# Altium schematic sheet Driver Motor.SchDoc
size A
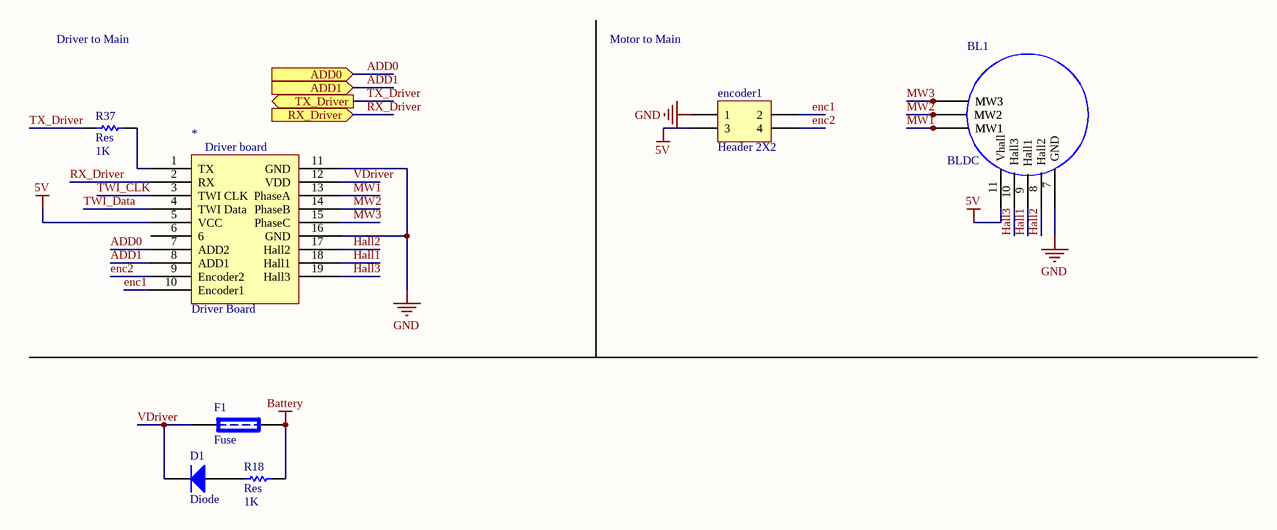
[diagram p0: Driver Motor.SchDoc]

## Parts
*  Driver Board  [Driver board]
BL1  BLDC  [FLT11]
D1  Diode  [2012[0805]]
encoder1  Header 2X2  [encoder 4pin]
F1  Fuse  [fuse kh]
R18  Res  value 1K  [2012[0805]]
R37  Res  value 1K  [2012[0805]]

## Ports
ADD0 (in), ADD1 (in), RX_Driver (in), TX_Driver (out)

## Nets
5V: *.5(VCC) BL1.11(Vhall) encoder1.3
Battery: F1.2 R18.1
GND: *.11(GND) *.16(GND) BL1.7(GND) encoder1.1
ADD0: *.7(ADD2) ; port ADD0
ADD1: *.8(ADD1) ; port ADD1
enc1: *.10(Encoder1) encoder1.2
enc2: *.9(Encoder2) encoder1.4
Hall1: *.18(Hall1) BL1.9(Hall1)
Hall2: *.17(Hall2) BL1.8(Hall2)
Hall3: *.19(Hall3) BL1.10(Hall3)
MW1: *.13(PhaseA) BL1.1(MW1) BL1.2(MW1)
MW2: *.14(PhaseB) BL1.3(MW2) BL1.4(MW2)
MW3: *.15(PhaseC) BL1.5(MW3) BL1.6(MW3)
RX_Driver: *.2(RX) ; port RX_Driver
TWI_CLK: *.3(TWI_CLK)
TWI_Data: *.4(TWI_Data)
TX_Driver: R37.2 ; port TX_Driver
VDriver: *.12(VDD) D1.2(K) F1.1
Net*_1: *.1(TX) R37.1
NetD1_1: D1.1(A) R18.2

Not connected (* = marked no-connect by the designer): * 6

## Notes on the sheet
- Driver to Main
- Motor to Main
- (in symbol Driver Board) Driver board

## Library data of the parts
D1 = Diode: 1 Amp General Purpose Rectifier; Revision 1: 11-Jul-2000: SIM Model Added.; Revision 2: 17-Jul-2002: Re-released for DXP Platform.; Package Information: Latest Revision: Aug-1999; Code - JEDEC: DO-204-AL; Published: 8-Jun-2000; Datasheet: Latest Revision: 1998; Package Reference: DO-41; Publisher: Altium Limited
encoder1 = Header 2X2: Header, 2-Pin, Dual row; LatestRevisionDate: 17-Jul-2002; LatestRevisionNote: Re-released for DXP Platform.; Publisher: Altium Limited
R18 R37 = Res: Semiconductor Resistor; Published: 8-Jun-2000; LatestRevisionDate: 17-Jul-2002; LatestRevisionNote: Re-released for DXP Platform.; PackageReference: AXIAL-0.5; Publisher: Altium Limited
F1 = Fuse: Published: 8-Jun-2000; LatestRevisionDate: 17-Jul-2002; LatestRevisionNote: Re-released for DXP Platform.; PackageReference: PIN-W2/E2.8; Publisher: Altium Limited